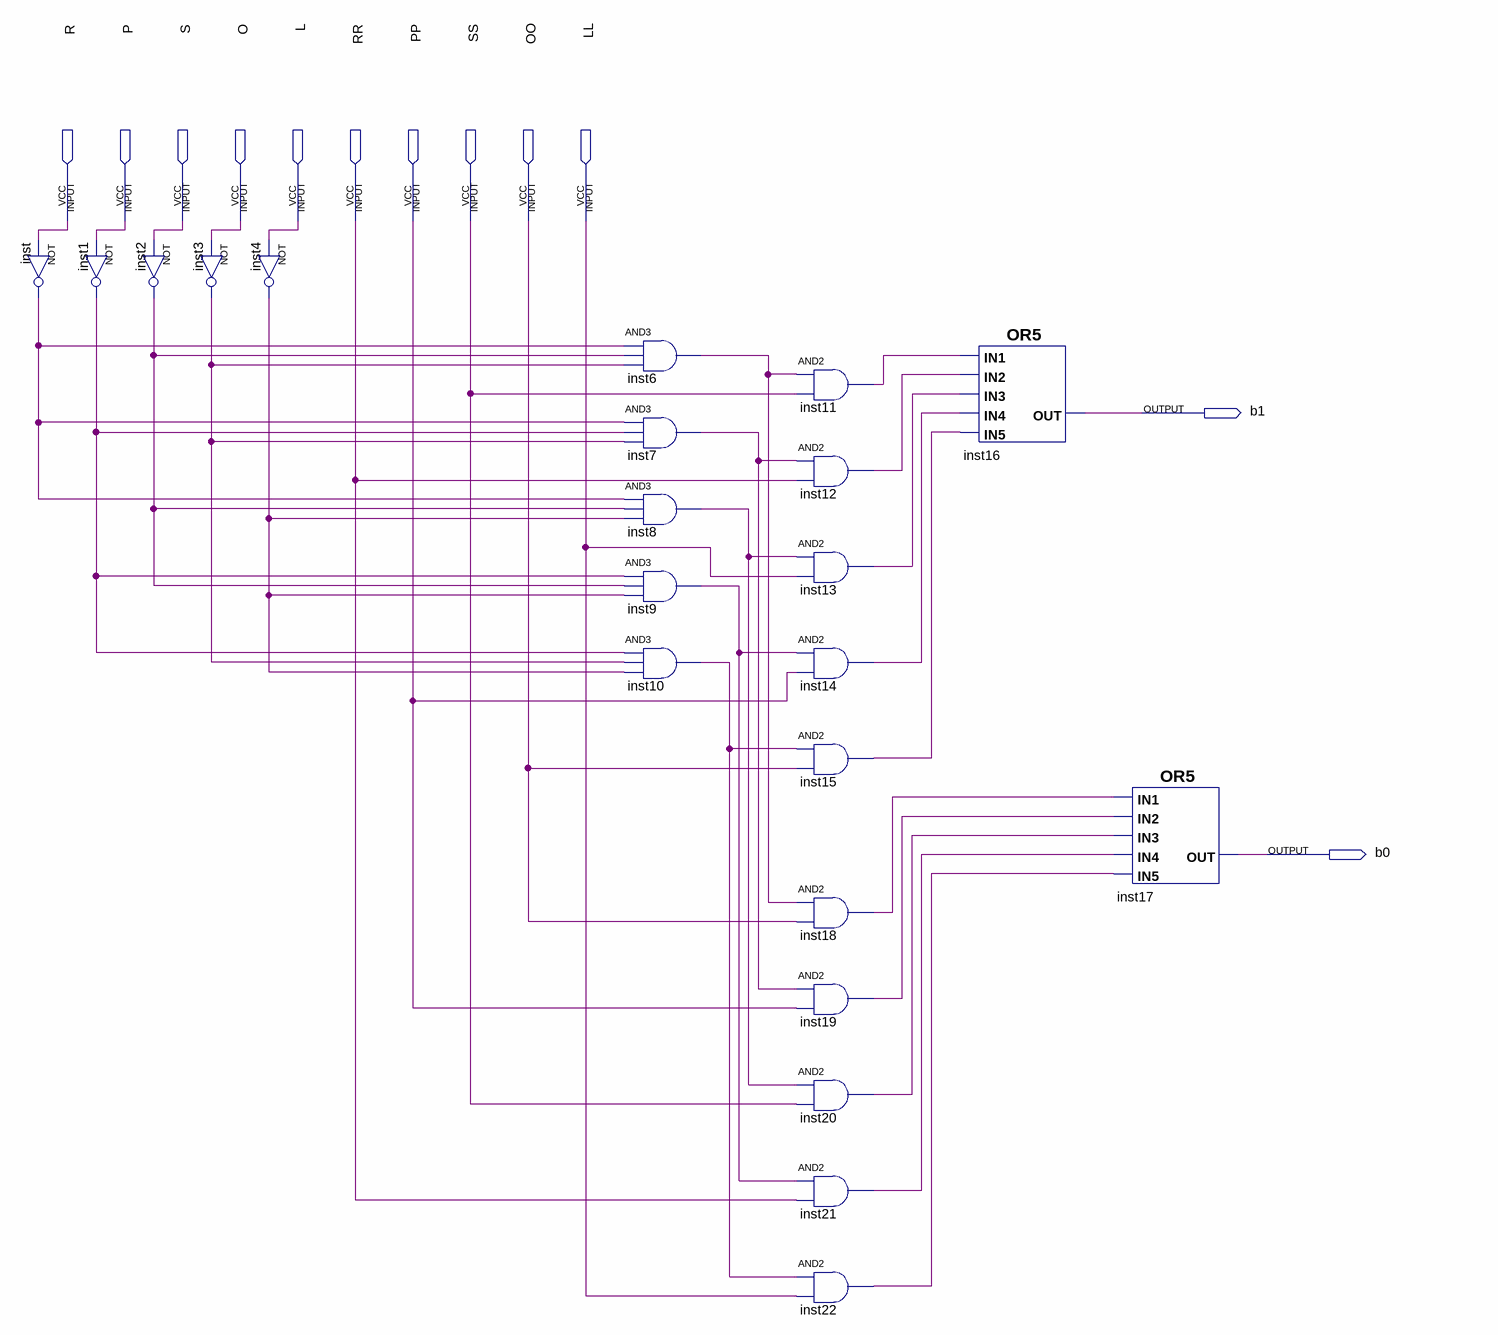
[diagram p0: schematic sheet]
// Quartus schematic whowins.bdf as structural Verilog: 22 symbols, 12 pins
module whowins (
  input  R,
  input  P,
  input  S,
  input  O,
  input  L,
  input  RR,
  input  PP,
  input  SS,
  input  OO,
  input  LL,
  output b1,
  output b0
);

  wire inst1_out, inst2_out, inst3_out, inst4_out, inst6_out, inst7_out, inst8_out, inst9_out, inst10_out,
       inst11_out, inst12_out, inst13_out, inst14_out, inst15_out, inst18_out, inst19_out, inst20_out,
       inst21_out, inst22_out, inst_out;

  not inst (inst_out, R);
  not inst1 (inst1_out, P);
  not inst2 (inst2_out, S);
  not inst3 (inst3_out, O);
  not inst4 (inst4_out, L);
  and inst6 (inst6_out, inst_out, inst2_out, inst3_out);
  and inst7 (inst7_out, inst_out, inst1_out, inst3_out);
  and inst8 (inst8_out, inst_out, inst2_out, inst4_out);
  and inst9 (inst9_out, inst1_out, inst2_out, inst4_out);
  and inst10 (inst10_out, inst1_out, inst3_out, inst4_out);
  and inst11 (inst11_out, inst6_out, SS);
  and inst12 (inst12_out, inst7_out, RR);
  and inst13 (inst13_out, inst8_out, LL);
  and inst14 (inst14_out, inst9_out, PP);
  and inst15 (inst15_out, inst10_out, OO);
  and inst18 (inst18_out, inst6_out, OO);
  and inst19 (inst19_out, inst7_out, PP);
  and inst20 (inst20_out, inst8_out, SS);
  and inst21 (inst21_out, inst9_out, RR);
  and inst22 (inst22_out, inst10_out, LL);
  or inst16 (b1, inst11_out, inst12_out, inst13_out, inst14_out, inst15_out);
  or inst17 (b0, inst18_out, inst19_out, inst20_out, inst21_out, inst22_out);
endmodule
